# EAGLE schematic potatoduino (EAGLE 7.7.0)
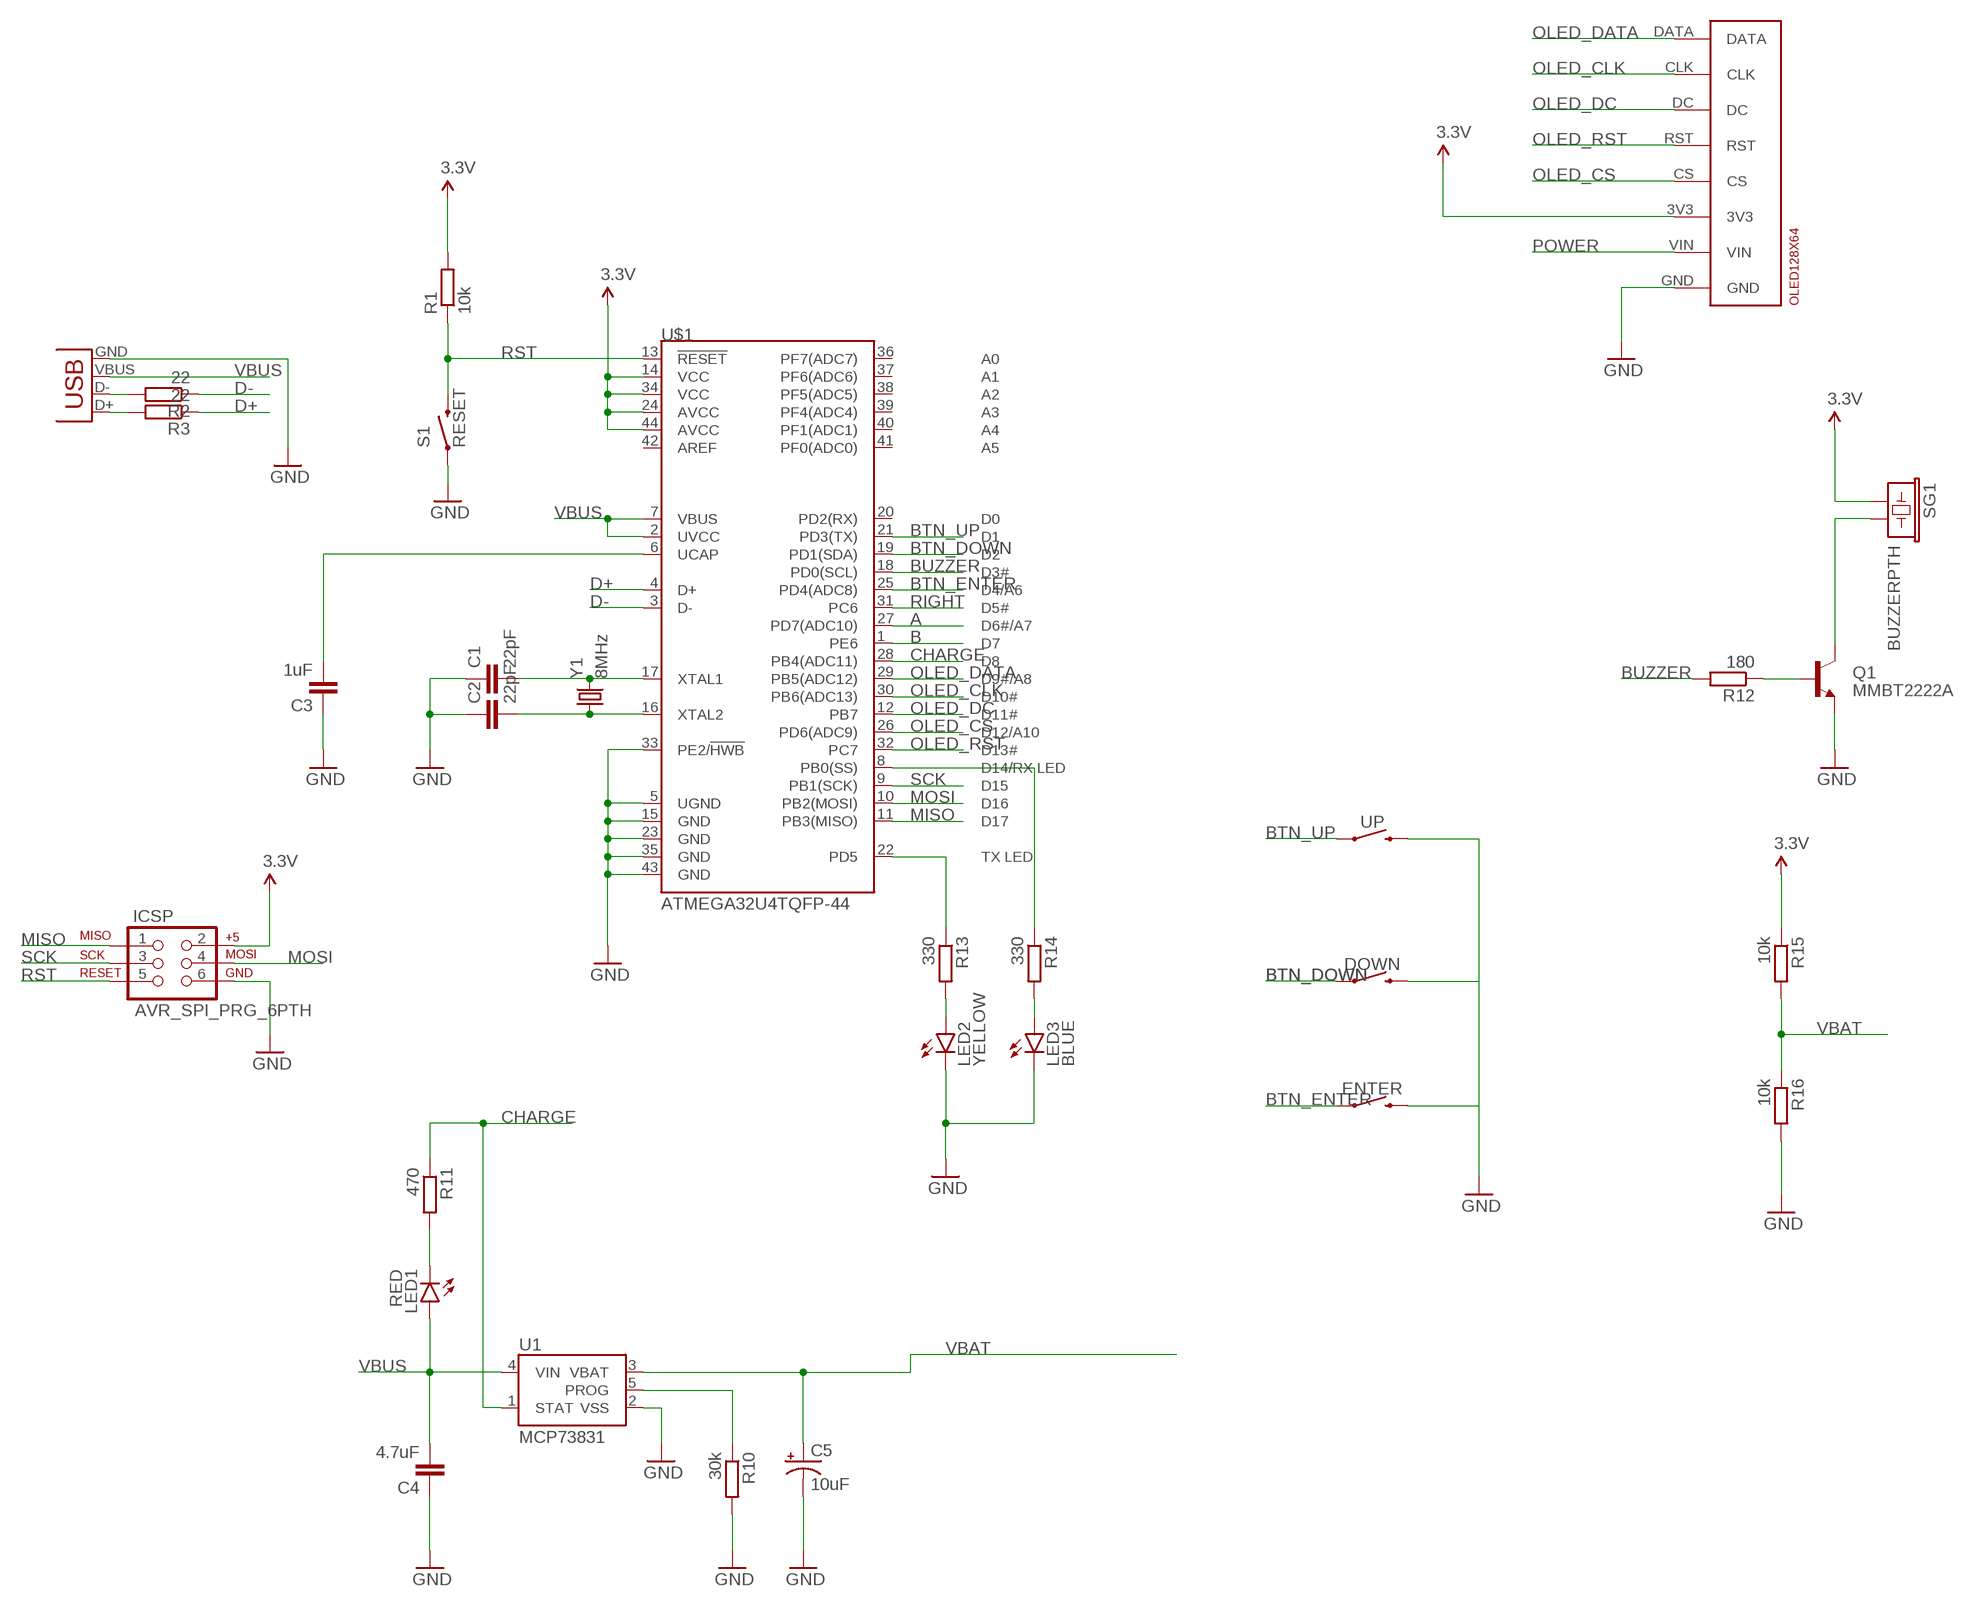
[diagram p0: schematic, sheet 1]

## Parts
C1  22pF  CAP1206  [1206]
C2  22pF  CAP1206  [1206]
C3  1uF  CAP1206  [1206]
C4  4.7uF  CAP1206  [1206]
C5  10uF  CAP_POL1206  [EIA3216]
DOWN  MOMENTARY-SWITCH-SPST-PTH-12MM  [TACTILE_SWITCH_PTH_12MM]
ENTER  MOMENTARY-SWITCH-SPST-PTH-12MM  [TACTILE_SWITCH_PTH_12MM]
ICSP  AVR_SPI_PRG_6PTH  [2X3]
JP1  USB-SMD-NS  [USB-MINIB-NOSTOP]
LED1  RED  LED0603  [LED-0603]
LED2  YELLOW  LED0603  [LED-0603]
LED3  BLUE  LED0603  [LED-0603]
OLED128X64  OLED128X64-ADAFRUIT938  [938]
Q1  MMBT2222A  TRANSISTOR_NPNMMBT2222A  [SOT23-3]
R1  10k  R-EU_M0805  [M0805]
R2  22  R-EU_M0805  [M0805]
R3  22  R-EU_M0805  [M0805]
R10  30k  R-EU_M0805  [M0805]
R11  470  R-EU_M0805  [M0805]
R12  180  R-EU_M0805  [M0805]
R13  330  R-EU_M0805  [M0805]
R14  330  R-EU_M0805  [M0805]
R15  10k  R-EU_M0805  [M0805]
R16  10k  R-EU_M0805  [M0805]
S1  RESET  SWITCH-MOMENTARY-2SMD  [TACTILE-SWITCH-SMD]
SG1  BUZZERPTH  [BUZZER-12MM]
U1  MCP73831  [SOT23-5]
U$1  ATMEGA32U4TQFP-44  [TQFP44]
UP  MOMENTARY-SWITCH-SPST-PTH-12MM  [TACTILE_SWITCH_PTH_12MM]
Y1  8MHz  CRYSTALHC49US  [HC49US]

## Nets
3.3V: ICSP.2 OLED128X64.3V3 R1.2 R15.1 SG1.+ U$1.14(VCC) U$1.24(AVCC) U$1.34(VCC) U$1.44(AVCC)
A: U$1.27(PD7(ADC10))
B: U$1.1(PE6)
BTN_DOWN: DOWN.1 U$1.19(PD1(SDA))
BTN_ENTER: ENTER.1 U$1.25(PD4(ADC8))
BTN_UP: U$1.21(PD3(TX)) UP.1
BUZZER: R12.2 U$1.18(PD0(SCL))
CHARGE: R11.1 U1.1(STAT) U$1.28(PB4(ADC11))
D+: R3.1 U$1.4(D+)
D-: R2.1 U$1.3(D-)
GND: C1.1 C2.1 C3.1 C4.1 C5.C(-) DOWN.3 ENTER.3 ICSP.6 JP1.GND LED2.C LED3.C OLED128X64.GND Q1.2(E) R10.2 R16.2 S1.1 U1.2(VSS) U$1.5(UGND) U$1.15(GND) U$1.23(GND) U$1.33(PE2/!HWB) U$1.35(GND) U$1.43(GND) UP.3
MISO: ICSP.1 U$1.11(PB3(MISO))
MOSI: ICSP.4 U$1.10(PB2(MOSI))
N$1: C1.2 U$1.17(XTAL1) Y1.2
N$2: C2.2 U$1.16(XTAL2) Y1.1
N$3: Q1.3(C) SG1.-
N$4: JP1.D- R2.2
N$5: JP1.D+ R3.2
N$6: C3.2 U$1.6(UCAP)
N$7: R10.1 U1.5(PROG)
N$9: LED1.C R11.2
N$11: Q1.1(B) R12.1
N$12: LED2.A R13.2
N$13: LED3.A R14.2
N$15: R13.1 U$1.22(PD5)
N$16: R14.1 U$1.8(PB0(SS))
OLED_CLK: OLED128X64.CLK U$1.30(PB6(ADC13))
OLED_CS: OLED128X64.CS U$1.26(PD6(ADC9))
OLED_DATA: OLED128X64.DATA U$1.29(PB5(ADC12))
OLED_DC: OLED128X64.DC U$1.12(PB7)
OLED_RST: OLED128X64.RST U$1.32(PC7)
POWER: OLED128X64.VIN
RIGHT: U$1.31(PC6)
RST: ICSP.5 R1.1 S1.3 U$1.13(!RESET)
SCK: ICSP.3 U$1.9(PB1(SCK))
VBAT: C5.A(+) R15.2 R16.1 U1.3(VBAT)
VBUS: C4.2 JP1.VBUS LED1.A U1.4(VIN) U$1.2(UVCC) U$1.7(VBUS)
Unconnected: U$1.20(PD2(RX)) U$1.36(PF7(ADC7)) U$1.37(PF6(ADC6)) U$1.38(PF5(ADC5)) U$1.39(PF4(ADC4)) U$1.40(PF1(ADC1)) U$1.41(PF0(ADC0)) U$1.42(AREF)

## Library data of the parts
C1-C4 = SparkFun-Passives:CAP: Capacitor Standard 0603 ceramic capacitor, and 0.1" leaded capacitor.
C5 = SparkFun-Capacitors:CAP_POL: Capacitor Polarized These are standard SMD and PTH capacitors. Normally 10uF, 47uF, and 100uF in electrolytic and tantalum varieties. Always verify the external diameter of the through hole cap, it varies with capacity, voltage, and manufacturer. The EIA devices should be standard.
DOWN ENTER UP = SparkFun-Switches:MOMENTARY-SWITCH-SPST: Momentary Switch (Pushbutton) - SPST Normally-open (NO) SPST momentary switches (buttons, pushbuttons). Variants PTH-12MM - 12mm square, through-hole Momentary Pushbutton Switch - 12mm Square <https://www.sparkfun.com/products/9190> (COM-09190) PTH-6.0MM, PTH-6.0MM-KIT - 6.0mm square, through-hole Mini Pushbutton Switch <https://www.sparkfun.com/products/97> (COM-00097) KIT package intended for soldering kit's - only one side of pads' copper is exposed. PTH-RIGHT-ANGLE-KIT - Right-angle, through-hole Right Angle Tactile Button <https://www.sparkfun.com/products/10791> - Used on SparkFun BigTime Watch Kit <https://www.sparkfun.com/products/11734> SMD-12MM - 12mm square, surface-mount Tactile Button - SMD (12mm) <https://www.sparkfun.com/products/12993> (COM-12993) Used on SparkFun PicoBoard <https://www.sparkfun.com/products/11888> SMD-4.5MM - 4.5mm Square Trackball Switch Used on SparkFun Blackberry Trackballer Breakout <https://www.sparkfun.com/products/13169> SMD-4.6MMX2.8MM - 4.60mm x 2.80mm, surface mount Used on SparkFun SAMD21 Mini Breakout <https://www.sparkfun.com/products/13664> SMD-5.2MM, SMD-5.2-REDUNDANT - 5.2mm square, surface-mount Mini Pushbutton Switch - SMD <https://www.sparkfun.com/products/8720> (COM-08720) Used on Arduino Pro Mini <https://www.sparkfun.com/products/11114> REDUNDANT package connects both switch circuits together SMD-6.0X3.5MM - 6.0 x 3.5mm, surface mount Momentary Reset Switch SMD <https://www.sparkfun.com/products/8229> (COM-08229) SMD-6.2MM-TALL - 6.2mm square, surface mount Tactile Button - SMD (6mm) <https://www.sparkfun.com/products/12992> Used on SparkFun Digital Sandbox <https://www.sparkfun.com/products/12651> SMD-RIGHT-ANGLE - Right-angle, surface mount Used on SparkFun Block for Intel® Edison - Arduino <https://www.sparkfun.com/products/13036>; PROD_ID: SWCH-09185; SF_SKU: COM-09190
ICSP = SparkFun-Connectors:AVR_SPI_PRG_6: AVR ISP 6 Pin This is the reduced ISP connector for AVR programming. Common on Arduino. This footprint will take up less PCB space and can be used with a 10-pin to 6-pin adapter such as SKU: BOB-08508 **Special note about "TEST_POINT" package. The stop mask is on the top side, so if you want your programming test points to be on the bottom of your board, make sure to place this package on the bottom side of the board. This also ensure that the orientation to program from the bottom side will be correct.
JP1 = SparkFun-Connectors:USB: USB Connectors USB-B-PTH is fully proven SKU : PRT-00139/CONN-08278 USB-miniB is fully proven SKU : PRT-00587 USB-A-PCB is untested. USB-A-H is throughly reviewed, but untested. Spark Fun Electronics SKU : PRT-00437 USB-B-SMT is throughly reviewed, but untested. Needs silkscreen touching up. USB-A-S has not been used/tested USB-MB-H has not been used/tested USB-MICROB has been used. CONN-09505
LED1-LED3 = SparkFun-LED:LED: LEDs Standard schematic elements and footprints for 5mm, 3mm, 1206, and 0603 sized LEDs. 5mm - Spark Fun Electronics SKU : COM-00529 (and others)
OLED128X64 = oled-128x64-adafruit-938:OLED128X64-ADAFRUIT938: Adafruit 938 - OLED 128x64 Oscar Gonzalez
Q1 = SparkFun-DiscreteSemi:TRANSISTOR_NPN: Generic NPN BJT MMBT2222A - TRANS-08049 (SOT-23, 1A 40V) MPSA42 - TRANS-09116 (SOT-23, 500mA 300V) MMBT5088LT1G - TRANS-11160 (SOT-23, 50 mA 30V) BC547 - COM-08928 <http://www.sparkfun.com/products/8928> (TO-92 45V 100mA) (1.Collector 2.Base 3.Emitter) 2N3904 - COM-00521 <http://www.sparkfun.com/products/521> (TO-92 40V 200mA) (1.Emitter 2.Base 3.Collector) P2N2222A - COM-12852 <http://www.sparkfun.com/products/12852> (TO-92 40V 600mA) (1.Collector 2.Base 3.Emitter); PROD_ID: TRANS-08049
R1-R3 R10-R16 = rcl:R-EU_: RESISTOR, European symbol
S1 = SparkFun-Electromechanical:SWITCH-MOMENTARY-2: Various NO switches- pushbuttons, reed, etc
SG1 = SparkFun-Electromechanical:BUZZER: Buzzer 12mm Spark Fun Electronics SKU : Comp-Buzzer
U1 = SparkFun-PowerIC:MCP73831: Miniature single cell, fully integrated Li-Ion, Li-polymer charge management controller http://ww1.microchip.com/downloads/en/DeviceDoc/21984a.pdf IC-09995; PROD_ID: IC-09995
U$1 = SparkFun-DigitalIC:ATMEGA32U4: Atmel 44-pin 8-bit Microcontroller with 32KBytes of ISP Flash and USB Controller
Y1 = SparkFun-FreqCtrl:CRYSTAL: Various standard crystals. Proven footprints. Spark Fun Electronics SKU : COM-00534